# Altium project JeffEncoder.PrjPcb
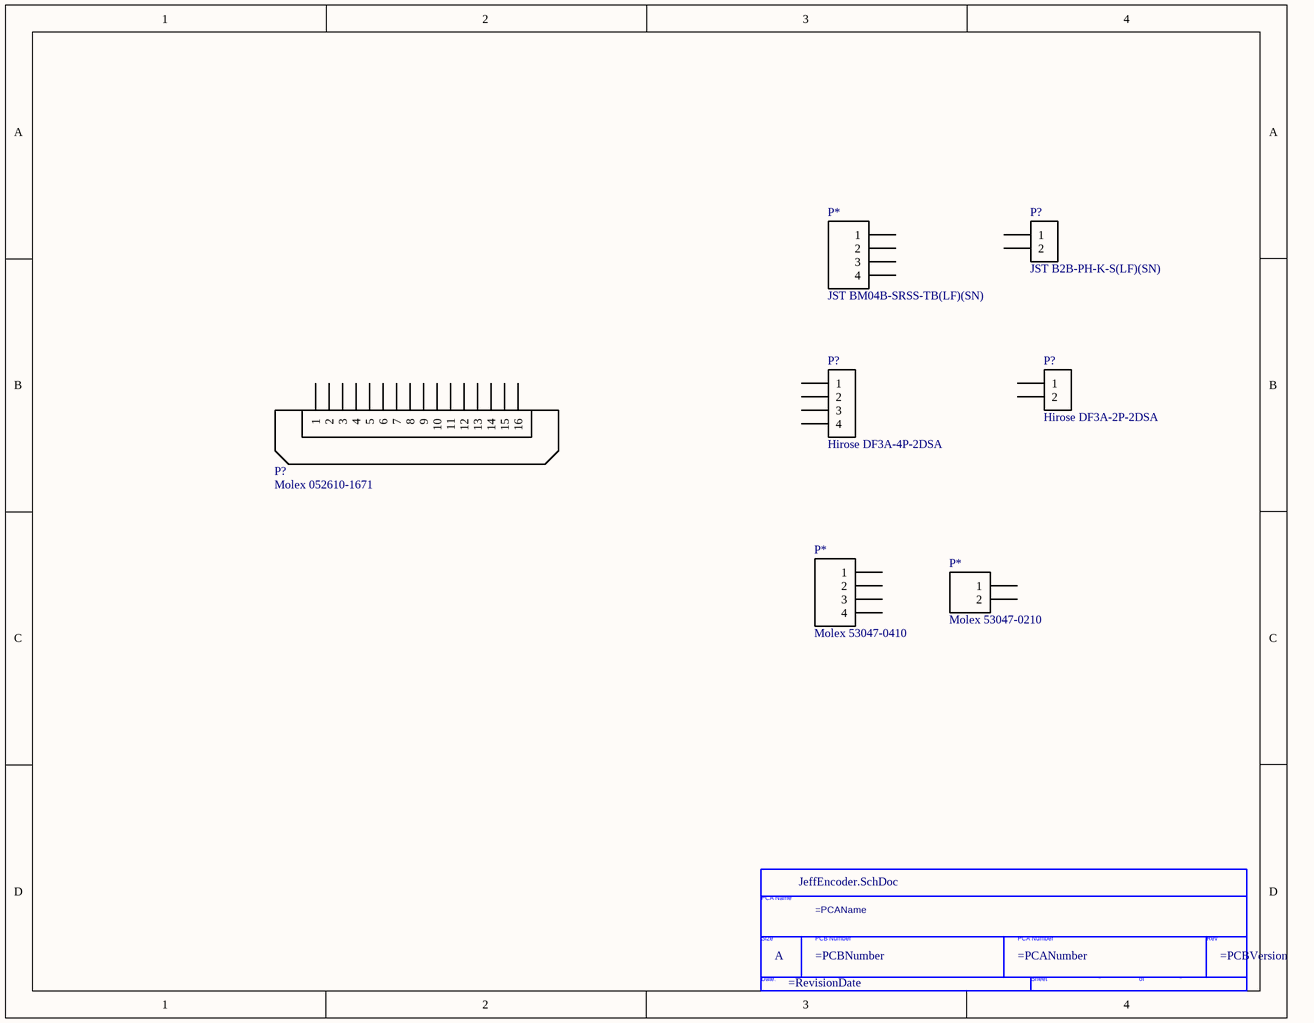
[diagram p0: JeffEncoder.SchDoc]
1 sheet, 8 parts. Net scope: global (net labels, ports and power ports of the same name join across sheets).
Board file: JeffEncoder.PcbDoc

## Sheet JeffEncoder.SchDoc
size A

### Parts
(Parts that share a designator on the sheet are numbered #1, #2 ... from top to bottom, then left to right.)
*  Page Size: A  (hidden comment: TitleBlock_Simplexity)  (graphical)
P*#1  JST BM04B-SRSS-TB(LF)(SN)  [JST BM04B-SRSS-TB(LF)(SN)]
P*#2  Molex 53047-0410  [MOLEX 53047-0410]
P*#3  Molex 53047-0210  [MOLEX 53047-0210]
P?#1  JST B2B-PH-K-S(LF)(SN)  [JST B2B-PH-K-S(LF)(SN)]
P?#2  Hirose DF3A-4P-2DSA  [HIROSE DF3A-4P-2DSA]
P?#3  Hirose DF3A-2P-2DSA  [HIROSE DF3A-2P-2DSA]
P?#4  Molex 052610-1671  [Molex 052610-1671]

### Nets

Not connected (* = marked no-connect by the designer): P*#1 1 2 3 4; P*#2 1 2 3 4; P*#3 1 2; P?#1 1 2; P?#2 1 2 3 4; P?#3 1 2; P?#4 1 2 3 4 5 6 7 8 9 10 11 12 13 14 15 16

### Notes on the sheet
- (in symbol TitleBlock_Simplexity) PCA Name; Size; PCB Number; PCA Number; Rev; Date:; Sheet; of

### Library data of the parts
P*#1 = JST BM04B-SRSS-TB(LF)(SN): JST 1mm, 4 pin; MPN: BM04B-SRSS-TB(LF)(SN); MFG: JST
P*#2 = Molex 53047-0410: Molex PicoBlade, 4 pin; MPN: 53047-0410; MFG: Molex
P*#3 = Molex 53047-0210: Molex PicoBlade, 2 pin; MPN: 53047-0210; MFG: Molex
P?#1 = JST B2B-PH-K-S(LF)(SN): 2 pin 2mm straight through hole; MFG: JST; MPN: B2B-PH-K-S(LF)(SN)
P?#2 = Hirose DF3A-4P-2DSA: 4 pin 2mm straight through hole; MFG: Hirose; MPN: DF3A-4P-2DSA
P?#3 = Hirose DF3A-2P-2DSA: 2 pin 2mm straight through hole; MFG: Hirose; MPN: DF3A-2P-2DSA
P?#4 = Molex 052610-1671: 16 pin FFC straight SMT; MFG: Molex; MPN: 052610-1671; MTG: SMT
* = TitleBlock_Simplexity: Page Create Date: March  8, 1995; PCB Number: =PCBNumber; RevCode: =PCBVersion; Title: =PCAName; Page Number: *; Page Count: *; Revision Date: =RevisionDate